# EAGLE design sensor_board_v0.52 (EAGLE 7.7.0)
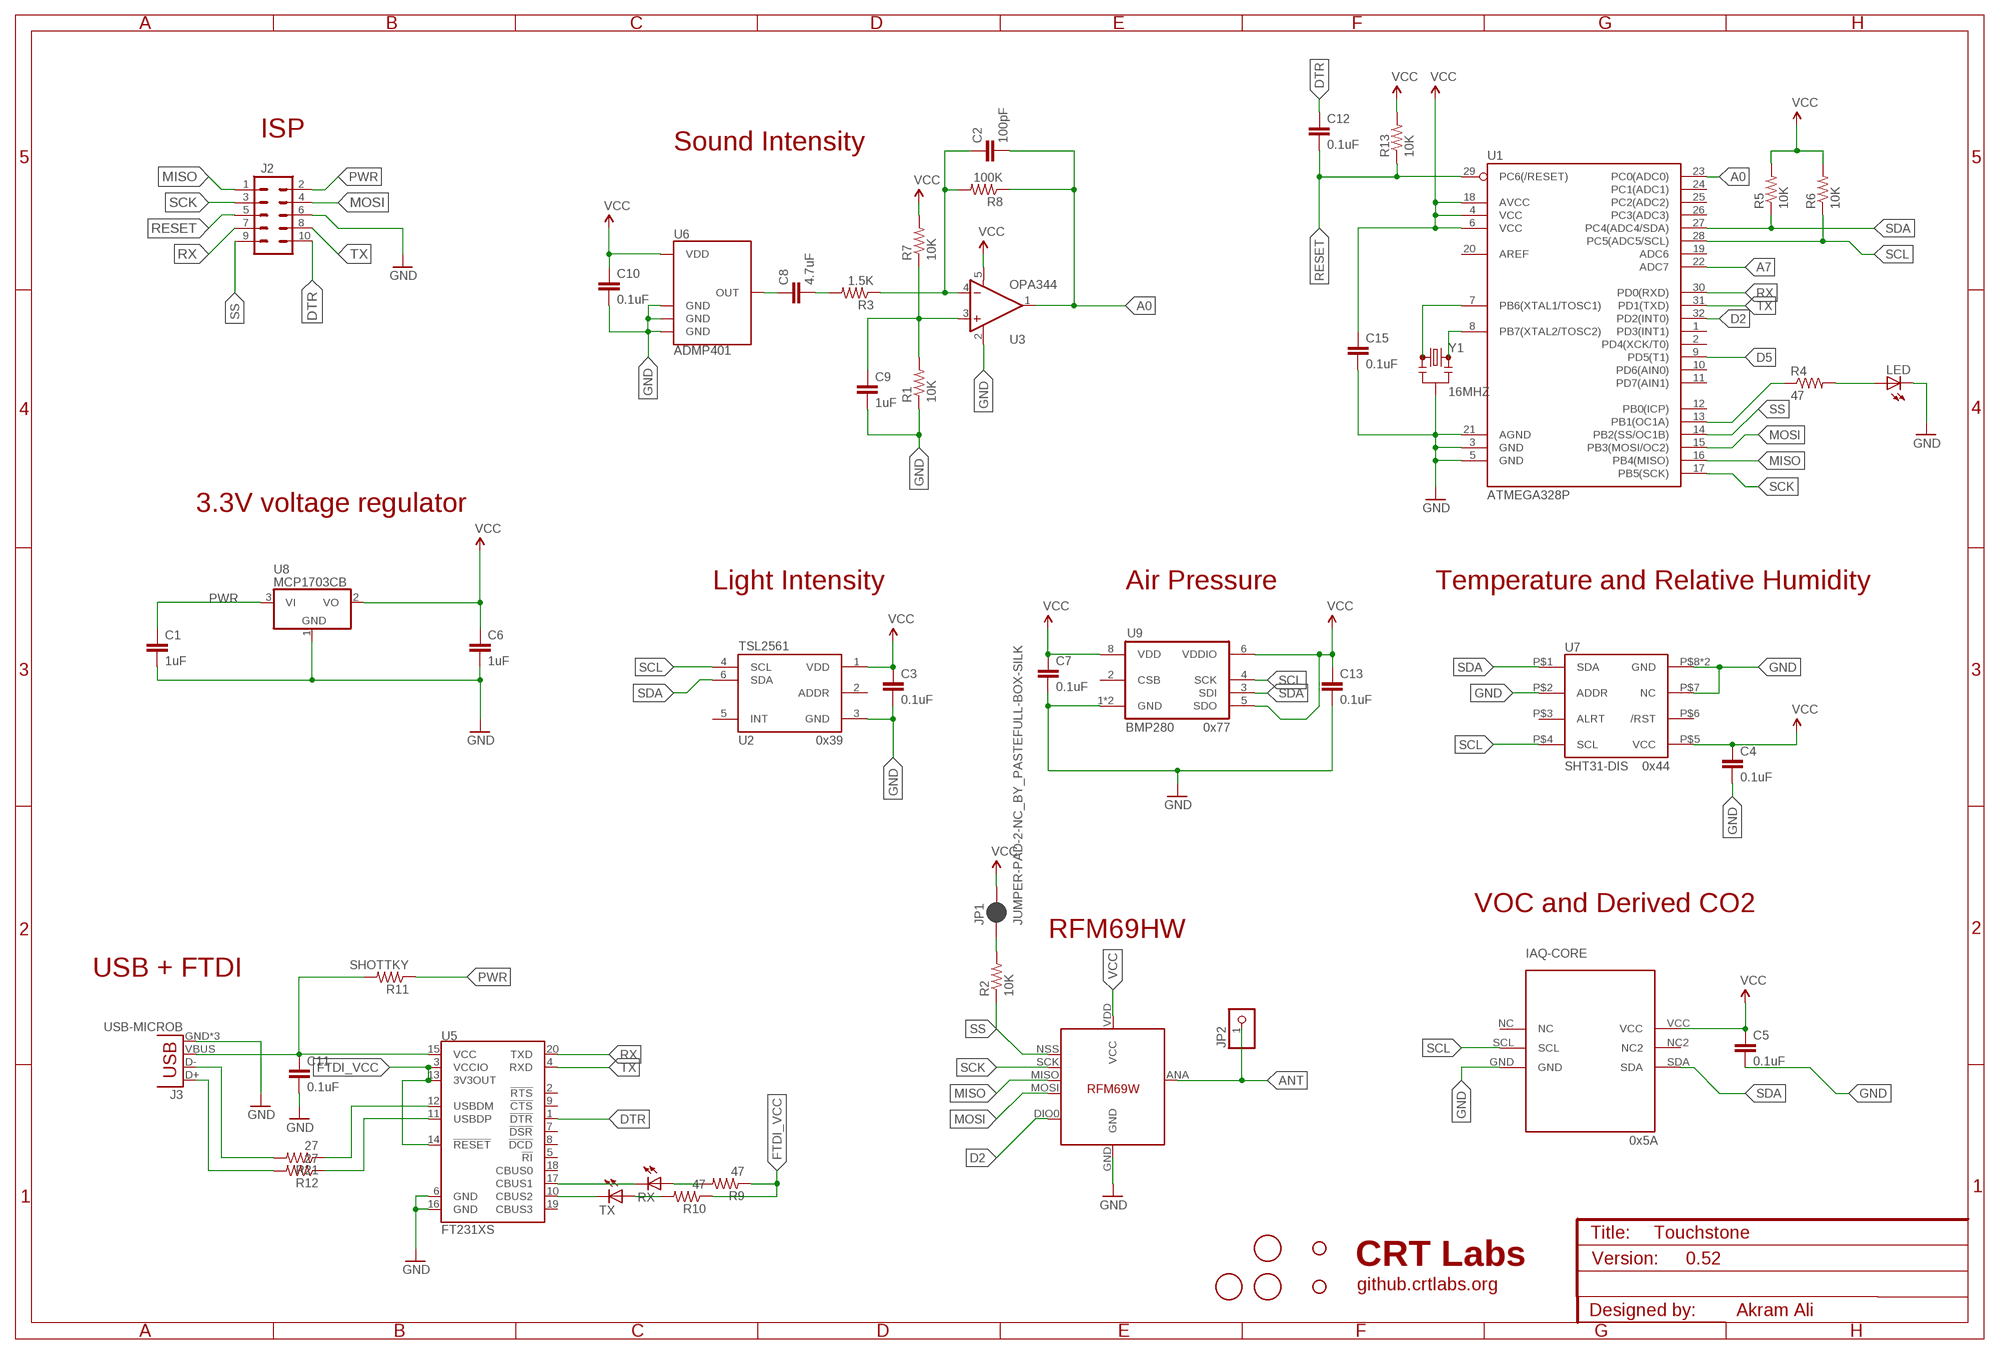
[diagram p0: schematic, sheet 1]

## Parts
C1  1uF  CAP0805  [0805]
C2  100pF  CAP0805  [0805]
C3  0.1uF  CAP0805  [0805]
C4  0.1uF  CAP0805  [0805]
C5  0.1uF  CAP0805  [0805]
C6  1uF  CAP0805  [0805]
C7  0.1uF  CAP0805  [0805]
C8  4.7uF  CAP0805  [0805]
C9  1uF  CAP0805  [0805]
C10  0.1uF  CAP0805  [0805]
C11  0.1uF  CAP0805  [0805]
C12  0.1uF  CAP0805  [0805]
C13  0.1uF  CAP0805  [0805]
C15  0.1uF  CAP0805  [0805]
H1  STAND-OFF  [STAND-OFF]
H2  STAND-OFF  [STAND-OFF]
IAQ-CORE  IAQ-CORE  [IAQ-CORE]
J2  M05X2PTH  [AVR_ICSP]
J3  USB-MICROB  [USB-MICROB]
JP1  JUMPER-PAD-2-NC_BY_PASTEFULL-BOX-SILK  [PAD-JUMPER-2-NC_BY_PASTE_YES_SILK_FULL_BOX]
JP2  PINHD-1X1  [1X01]
LED  LEDCHIPLED_0805  [CHIPLED_0805]
R1  10K  RESISTOR0805-RES  [0805]
R2  10K  RESISTOR0805-RES  [0805]
R3  1.5K  RESISTOR0805-RES  [0805]
R4  47  RESISTOR0805-RES  [0805]
R5  10K  RESISTOR0805-RES  [0805]
R6  10K  RESISTOR0805-RES  [0805]
R7  10K  RESISTOR0805-RES  [0805]
R8  100K  RESISTOR0805-RES  [0805]
R9  47  RESISTOR0805-RES  [0805]
R10  47  RESISTOR0805-RES  [0805]
R11  SHOTTKY  RESISTOR0805-RES  [0805]
R12  27  RESISTOR0805-RES  [0805]
R13  10K  RESISTOR0805-RES  [0805]
R21  27  RESISTOR0805-RES  [0805]
RX  LEDCHIPLED_0805  [CHIPLED_0805]
TX  LEDCHIPLED_0805  [CHIPLED_0805]
U1  ATMEGA328P  ATMEGA328P_TQFP  [TQFP32-08]
U2  TSL2561  TSL2561FN  [FN-6]
U3  OPA344  [SOT23-5]
U4  RFM69HW  LOWPOWERLAB_RFM69  [LOWPOWERLAB_RFM69W-MINPADS]
U5  FT231XS  [SSOP20_L]
U6  ADMP401  [ADMP401]
U7  SHT31-DIS  [SHT3X]
U8  MCP1703CB  [SOT23]
U9  BMP280  [BMP280]
U$1  FIDUCIAL  [FIDUCIAL_1MM]
U$2  FIDUCIAL  [FIDUCIAL_1MM]
U$3  FIDUCIAL  [FIDUCIAL_1MM]
Y1  16MHZ  RESONATOR16MHZ  [RESONATOR-SMD]

## Nets
A0: C2.2 R8.1 U1.23(PC0(ADC0)) U3.1(OUT)
A7: U1.22(ADC7)
ANT: JP2.1 U4.ANA(ANT)
D2: U1.32(PD2(INT0)) U4.DIO0
D5: U1.9(PD5(T1))
DTR: C12.1 J2.10 U5.1(!DTR)
FTDI_VCC: R9.1 R10.1 U5.3(VCCIO) U5.13(3V3OUT) U5.14(!RESET)
GND: C1.2 C3.2 C4.2 C5.2 C6.2 C7.2 C9.2 C10.2 C11.2 C13.2 C15.2 IAQ-CORE.GND J2.6 J3.GND J3.MT1(GND) J3.MT2(GND) LED.C R1.1 U1.3(GND) U1.5(GND) U1.21(AGND) U2.3(GND) U3.2(V-) U4.GND U5.6(GND) U5.16(GND) U6.2(GND) U6.4(GND) U6.6(GND) U7.P$2(ADDR) U7.P$7(NC) U7.P$8(GND) U7.PAD(GND) U8.1(GND) U9.1(GND) U9.7(GND) Y1.2
MISO: J2.1 U1.16(PB4(MISO)) U4.MISO
MOSI: J2.4 U1.15(PB3(MOSI/OC2)) U4.MOSI
N$1: JP1.1 R2.2
N$2: R4.1 U1.13(PB1(OC1A))
N$3: LED.A R4.2
N$4: U1.8(PB7(XTAL2/TOSC2)) Y1.3
N$5: U1.7(PB6(XTAL1/TOSC1)) Y1.1
N$9: C8.2 R3.2
N$10: C2.1 R3.1 R8.2 U3.4(-IN)
N$11: C9.1 R1.2 R7.1 U3.3(+IN)
N$17: RX.C U5.17(CBUS1)
N$18: TX.C U5.10(CBUS2)
N$25: R21.1 U5.12(USBDM)
N$26: R12.1 U5.11(USBDP)
N$27: R9.2 RX.A
N$29: R10.2 TX.A
N$32: J3.D- R21.2
N$33: J3.D+ R12.2
OUT: C8.1 U6.1(OUT)
PWR: C1.1 J2.2 R11.1 U8.3(VI)
RESET: C12.2 J2.5 R13.1 U1.29(PC6(/RESET))
RX: J2.7 U1.30(PD0(RXD)) U5.20(TXD)
SCK: J2.3 U1.17(PB5(SCK)) U4.SCK
SCL: IAQ-CORE.SCL R6.1 U1.28(PC5(ADC5/SCL)) U2.4(SCL) U7.P$4(SCL) U9.4(SCK)
SDA: IAQ-CORE.SDA R5.1 U1.27(PC4(ADC4/SDA)) U2.6(SDA) U7.P$1(SDA) U9.3(SDI)
SS: J2.9 R2.1 U1.14(PB2(SS/OC1B)) U4.NSS(SEL)
TX: J2.8 U1.31(PD1(TXD)) U5.4(RXD)
VBUS: C11.1 J3.VBUS R11.2 U5.15(VCC)
VCC: C3.1 C4.1 C5.1 C6.1 C7.1 C10.1 C13.1 C15.1 IAQ-CORE.VCC JP1.2 R5.2 R6.2 R7.2 R13.2 U1.4(VCC) U1.6(VCC) U1.18(AVCC) U2.1(VDD) U3.5(V+) U4.VDD(VCC) U6.5(VDD) U7.P$5(VCC) U8.2(VO) U9.5(SDO) U9.6(VDDIO) U9.8(VDD)
Unconnected: IAQ-CORE.NC IAQ-CORE.NC2 U1.1(PD3(INT1)) U1.2(PD4(XCK/T0)) U1.10(PD6(AIN0)) U1.11(PD7(AIN1)) U1.12(PB0(ICP)) U1.19(ADC6) U1.20(AREF) U1.24(PC1(ADC1)) U1.25(PC2(ADC2)) U1.26(PC3(ADC3)) U2.2(ADDR) U2.5(INT) U5.2(!RTS) U5.5(!RI) U5.7(!DSR) U5.8(!DCD) U5.9(!CTS) U5.18(CBUS0) U5.19(CBUS3) U7.P$3(ALRT) U7.P$6(/RST) U9.2(CSB)

## Notes on the sheet
- ISP
- Sound Intensity
- 3.3V voltage regulator
- Light Intensity | Air Pressure | Temperature and Relative Humidity
- 0x77
- 0x39
- 0x44
- VOC and Derived CO2
- RFM69HW
- USB + FTDI
- 0x5A
- Touchstone
- CRT Labs | 0.52
- github.crtlabs.org
- Akram Ali

## Library data of the parts
C1 C2 C6 C8-C11 = SparkFun-Capacitors:CAP: Capacitor Standard 0603 ceramic capacitor, and 0.1" leaded capacitor.; OC_NEWARK: unknown
C3-C5 = SparkFun-Passives:CAP: Capacitor Standard 0603 ceramic capacitor, and 0.1" leaded capacitor.; OC_NEWARK: unknown
C7 C12 C13 C15 = SparkFun-Passives:CAP: Capacitor Standard 0603 ceramic capacitor, and 0.1" leaded capacitor.
H1 H2 = SparkFun-Electromechanical:STAND-OFF: #4 Stand Off This is the mechanical footprint for a #4 phillips button head screw. Use the keepout ring to avoid running the screw head into surrounding components. SKU : PRT-00447
IAQ-CORE = IAQ-CORE:IAQ-CORE; MPN: IAQ CORE; OC_NEWARK: 82Y5455
J2 = SparkFun-Connectors:M05X2: Header 5x2 Standard 10-pin dual row 0.1" header. Commonly used with AVR-ISP. Use with Spark Fun Electronics SKU: PRT-00778
J3 = SparkFun-Connectors:USB: USB Connectors USB-B-PTH is fully proven SKU : PRT-00139/CONN-08278 USB-miniB is fully proven SKU : PRT-00587 USB-A-PCB is untested. USB-A-H is throughly reviewed, but untested. Spark Fun Electronics SKU : PRT-00437 USB-B-SMT is throughly reviewed, but untested. Needs silkscreen touching up. USB-A-S has not been used/tested USB-MB-H has not been used/tested USB-MICROB has been used. CONN-09505; PROD_ID: CONN-09505
JP1 = SparkFun-Passives:JUMPER-PAD-2-NC_BY_PASTE
JP2 = adafruit:PINHD-1X1: Pin header 1x1 for 0.1" spacing With round pins
LED RX TX = adafruit:LED: LED OSRAM: - CHIPLED LG R971, LG N971, LY N971, LG Q971, LY Q971, LO R971, LY R971 LH N974, LH R974 LS Q976, LO Q976, LY Q976 LO Q996 - Hyper CHIPLED LW Q18S LB Q993, LB Q99A, LB R99A - SideLED LS A670, LO A670, LY A670, LG A670, LP A670 LB A673, LV A673, LT A673, LW A673 LH A674 LY A675 LS A676, LA A676, LO A676, LY A676, LW A676 LS A679, LY A679, LG A679 - Hyper Micro SIDELED® LS Y876, LA Y876, LO Y876, LY Y876 LT Y87S - SmartLED LW L88C, LW L88S LB L89C, LB L89S, LG L890 LS L89K, LO L89K, LY L89K LS L896, LA L896, LO L896, LY L896 - TOPLED LS T670, LO T670, LY T670, LG T670, LP T670 LSG T670, LSP T670, LSY T670, LOP T670, LYG T670 LG T671, LOG T671, LSG T671 LB T673, LV T673, LT T673, LW T673 LH T674 LS T676, LA T676, LO T676, LY T676, LB T676, LH T676, LSB T676, LW T676 LB T67C, LV T67C, LT T67C, LS T67K, LO T67K, LY T67K, LW E67C LS E67B, LA E67B, LO E67B, LY E67B, LB E67C, LV E67C, LT E67C LW T67C LS T679, LY T679, LG T679 LS T770, LO T770, LY T770, LG T770, LP T770 LB T773, LV T773, LT T773, LW T773 LH T774 LS E675, LA E675, LY E675, LS T675 LS T776, LA T776, LO T776, LY T776, LB T776 LHGB T686 LT T68C, LB T68C - Hyper Mini TOPLED® LB M676 - Mini TOPLED Santana® LG M470 LS M47K, LO M47K, LY M47K Source: http://www.osram.convergy.de/; OC_NEWARK: unknown
R1 R3 R7-R12 R21 = SparkFun-Passives:RESISTOR: Resistor Basic schematic elements and footprints for 0603, 1206, and PTH resistors.; OC_NEWARK: unknown
R2 R13 = SparkFun-Passives:RESISTOR: Resistor Basic schematic elements and footprints for 0603, 1206, and PTH resistors.
R4-R6 = SparkFun-Resistors:RESISTOR: Resistor Basic schematic elements and footprints for 0603, 1206, and PTH resistors.; OC_NEWARK: unknown
U1 = SparkFun-DigitalIC:ATMEGA328P_TQFP; MPN: ATMEGA328PB-AU; OC_NEWARK: 58Y6083; PROD_ID: IC-09069; VALUE: ATMEGA328P_TQFP
U2 = SparkFun-DigitalIC:TSL2561: TSL2561 illumination sensor Approximates Human Eye Response Precisely Measures Illuminance Programmable Interrupt Function with User-Defined Upper and Lower Threshold 400 KHz I2C interface Programmable Analog Gain and Integration Time Supporting 1,000,000-to-1 Dynamic Range Automatically Rejects 50/60-Hz Lighting Ripple Low Active Power (0.75 mW Typical) with Power Down Mode RoHS Compliant The TSL2561 is a light-to-digital converter that transform light intensity to a digital signal output via I2C interface. The device combines one broadband photodiode (visible plus infrared) and one infrared-responding photodiode on a single CMOS integrated circuit capable of providing a near-photopic response over an effective 20-bit dynamic range (16-bit resolution). Two integrating ADCs convert the photodiode currents to a digital output that represents the irradiance measured on each channel. This digital output can be input to a microprocessor where illuminance (ambient light level) in lux is derived using an empirical formula to approximate the human eye response. The TSL2561 device supports a traditional level style interrupt that remains asserted until the firmware clears it.; DIGIKEY#: TSL2561-FNCT-ND; MANF: AMS-TAOS-USA-Inc.; MANF#: TSL2561FN; MOUSER#: 856-TSL2561T; MPN: TSL2561FN; OC_NEWARK: 82Y5564; PROD_ID: IC-11791
U3 = SparkFun-AnalogIC:OPA344: Single gate rail-to-rail output op-amp. Inputs extend 300mV past rails.; PROD_ID: IC-08251
U4 = RFM69 USB Gateway:LOWPOWERLAB_RFM69
U5 = SparkFun-DigitalIC:FT231X: FTDI FT231X Full Speed USB to Full-handshake UART This USB2.0 Full Speed IC offers a compact bridge to full handshake UART interfaces. The device is a UART, capable of operating up to 3MBaud, with low power consumption (8mA). The FT231X includes the complete FT-X series feature set and enables USB to be added into a system design quickly and easily over a UART interface.; PROD_ID: IC-11524
U6 = SparkFun-Sensors:ADMP401: Omnidirection bottom-port MEMS microphone
U7 = thomasb9511:SHT31-DIS; MPN: SHT31-DIS-B; OC_NEWARK: 47Y1304
U8 = linear:MCP1703: 250 mA, 16V, Low Quiescent Current LDO Regulator Source: http://ww1.microchip.com/downloads/en/DeviceDoc/22049b.pdf; MPN: MCP1703T-2502E/CB; OC_NEWARK: 18T9177
U9 = bosch-bmp280:BMP280: The BMP280 is an absolute barometric pressure sensor especially designed for mobile applications. The sensor module is housed in an extremely compact 8-pin metal-lid LGA package with a footprint of only 2.0 × 2.5 mm2 and 0.95 mm package height. Its small dimensions and its low power consumption of 2.7 μA @1Hz allow the implementation in battery driven devices such as mobile phones, GPS modules or watches. The library has been designed by Richard Magdycz <https://www.facebook.com/groups/eaglecadsoftUK>
U$1-U$3 = adafruit:FIDUCIAL: For use by pick and place machines to calibrate the vision/machine, 1mm By microbuilder.eu
Y1 = SparkFun-FreqCtrl:RESONATOR: Resonator Small SMD resonator. Used, eg, on the Arduino Pro/ Pro Mini boards. 8MHz- XTAL-08895 16MHz- XTAL-08900; OC_NEWARK: unknown; PROD_ID: XTAL-08900

## Board
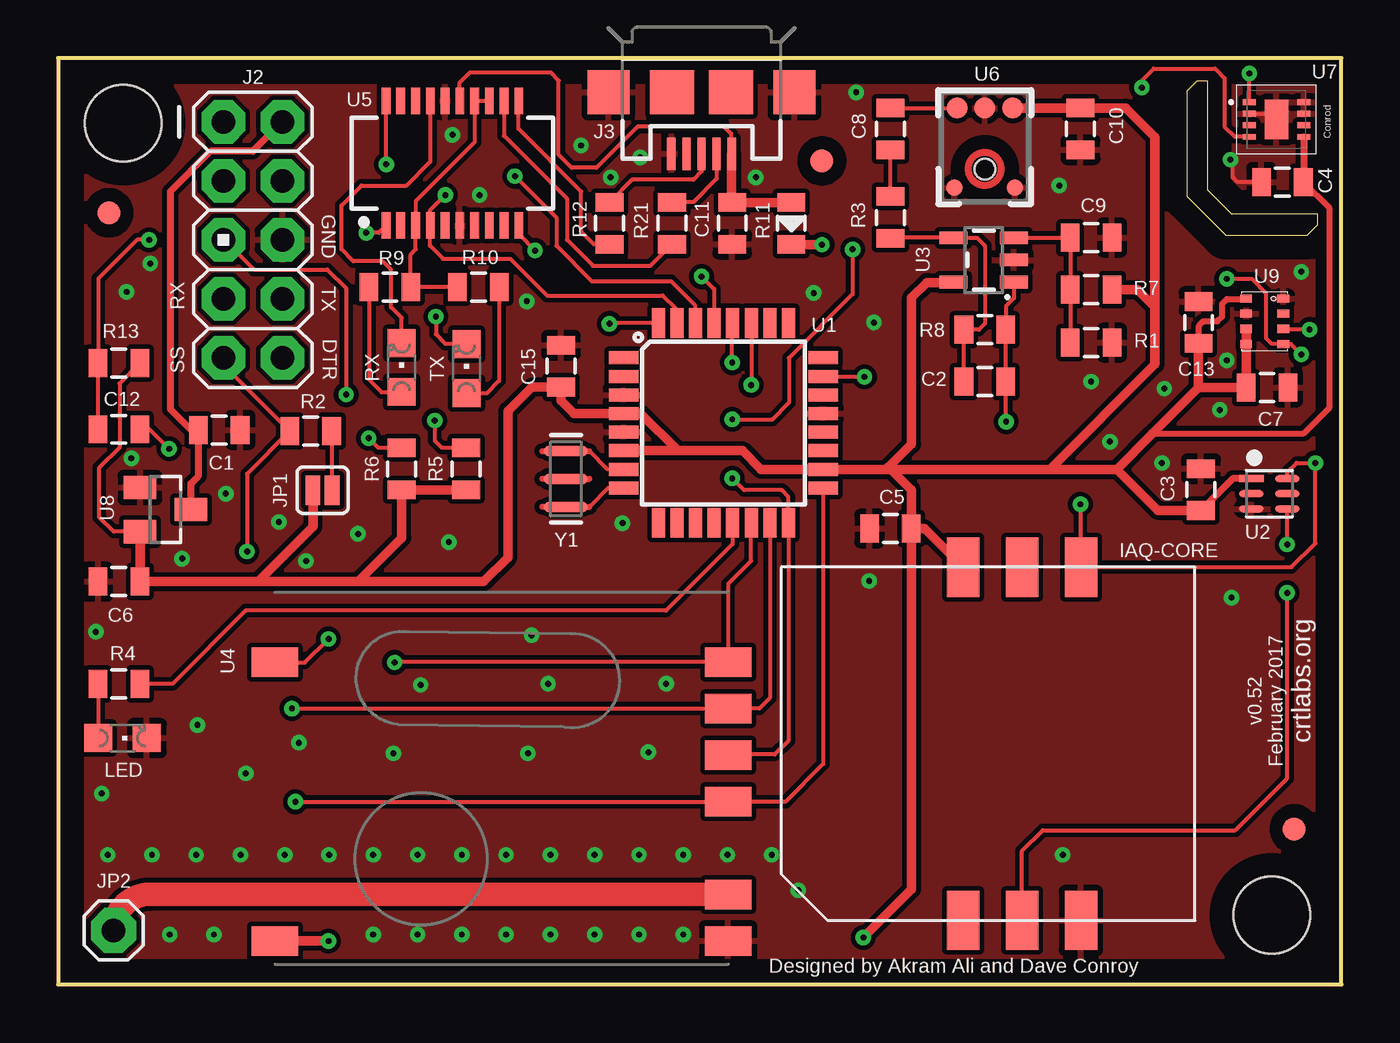
[diagram p1: board, top side]
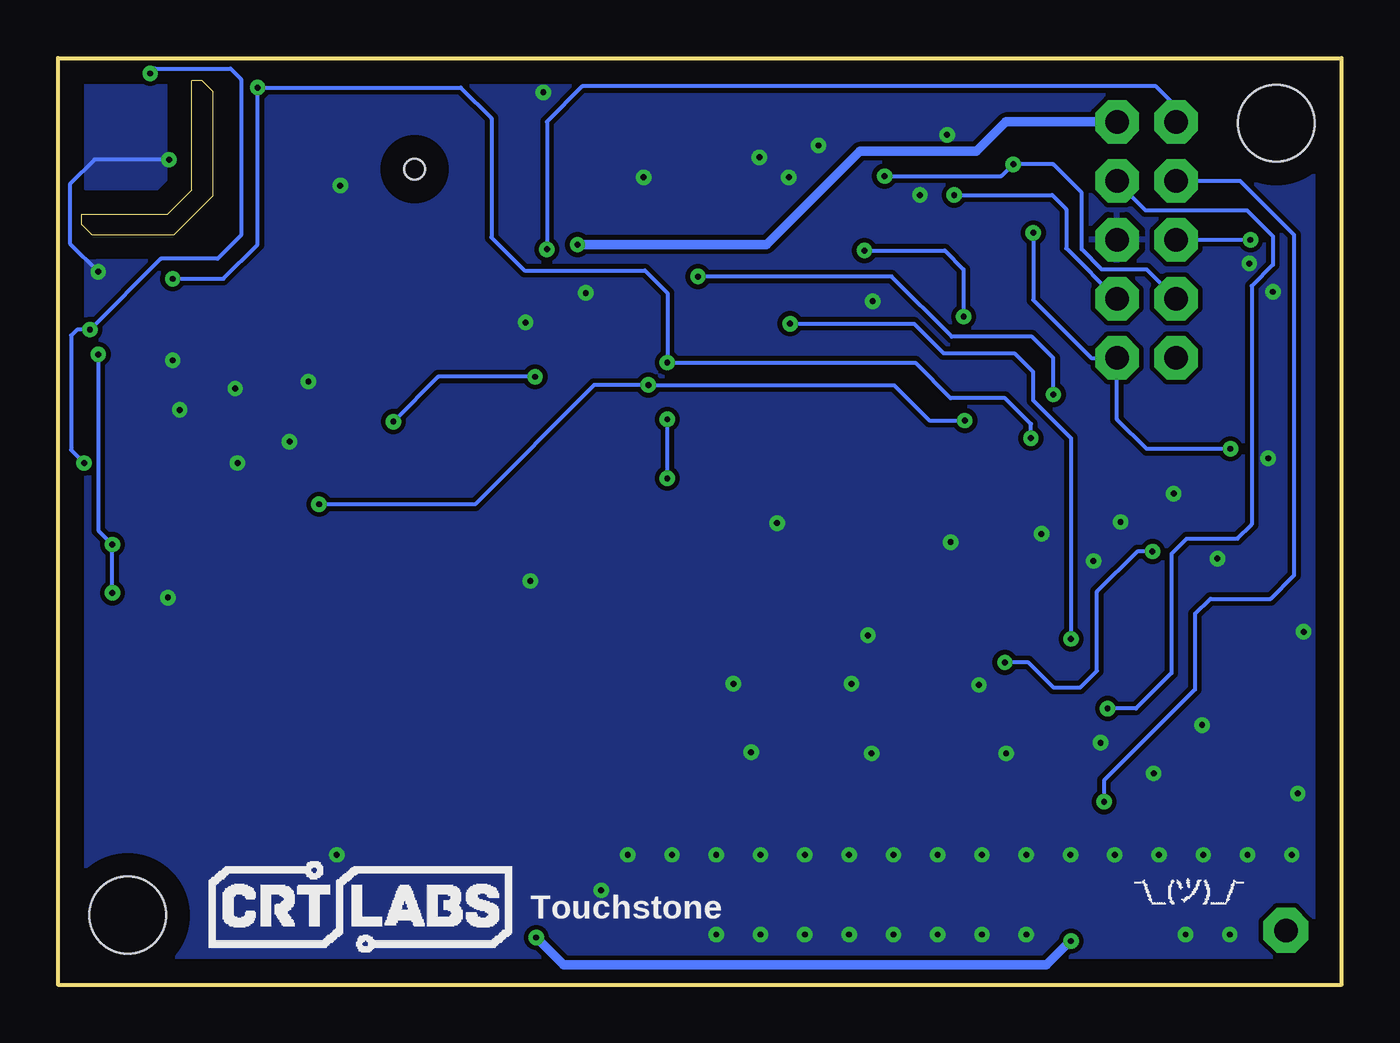
[diagram p2: board, bottom side, seen from below]

Size 55.22 x 39.88 mm. Coordinates in mm from the lower left corner, seen from the top.
Outline: 0,39.88 0,0 55.22,0 55.22,39.88 0,39.88
Outline: 49.48,34.19 49.48,38.91 49.02,38.91 48.56,38.46 48.56,33.93 50.24,32.26 53.75,32.26 54.2,32.72 54.2,33.17 50.5,33.17 49.48,34.19
Copper layers (1*16): Top 0.035mm / dielectric 1.5mm / Bottom 0.035mm
Design rules "default": minimum track width 10mil, minimum drill 24mil, track to track 8mil, track to pad 8mil, pad to pad 8mil, via to via 8mil, smd to smd 8mil, copper to edge 40mil, drill to drill 8mil, minimum pad ring 10mil, minimum via ring 8mil, stop-mask expansion 4mil, vias tented up to drill 0mil, thermal gap 10mil

### Footprints (pad centres in the part's own frame; a part is rotated, then mirrored left to right if it is on the bottom)
0805 = smd 0.8 x 1.2: 1 -0.9,0; 2 0.9,0
STAND-OFF = hole 3.302: 0,0
IAQ-CORE = smd 2.54 x 1.4: GND 0,-12.9; NC 0,-7.82; NC2 15.2,-10.36; SCL 0,-10.36; SDA 15.2,-12.9; VCC 15.2,-7.82
AVR_ICSP = drill 1.016 pad 1.88 octagon: 1 -1.27,5.08; 2 1.27,5.08; 3 -1.27,2.54; 4 1.27,2.54; 5 -1.27,0; 6 1.27,0; 7 -1.27,-2.54; 8 1.27,-2.54; 9 -1.27,-5.08; 10 1.27,-5.08
USB-MICROB = smd 0.35 x 1.4: D+ 0,2.65; D- -0.65,2.65; GND 1.3,2.65; ID 0.65,2.65; VBUS -1.3,2.65 | smd 1.8 x 1.9: MT1 -4,0; MT2 4,0 | smd 1.9 x 1.9: P$1 -1.27,0; P$2 1.27,0
PAD-JUMPER-2-NC_BY_PASTE_YES_SILK_FULL_BOX = smd 0.635 x 1.27: 1 -0.412,0; 2 0.412,0
1X01 = drill 1.016 pad 1.93 octagon: 1 0,0
CHIPLED_0805 = smd 1.2 x 1.2: A 0,-1.05; C 0,1.05
TQFP32-08 = smd 1.27 x 0.559: 1 -4.293,2.8; 2 -4.293,2; 3 -4.293,1.2; 4 -4.293,0.4; 5 -4.293,-0.4; 6 -4.293,-1.2; 7 -4.293,-2; 8 -4.293,-2.8; 17 4.293,-2.8; 18 4.293,-2; 19 4.293,-1.2; 20 4.293,-0.4; 21 4.293,0.4; 22 4.293,1.2; 23 4.293,2; 24 4.293,2.8 | smd 0.559 x 1.27: 9 -2.8,-4.293; 10 -2,-4.293; 11 -1.2,-4.293; 12 -0.4,-4.293; 13 0.4,-4.293; 14 1.2,-4.293; 15 2,-4.293; 16 2.8,-4.293; 25 2.8,4.293; 26 2,4.293; 27 1.2,4.293; 28 0.4,4.293; 29 -0.4,4.293; 30 -1.2,4.293; 31 -2,4.293; 32 -2.8,4.293
FN-6 = smd 1.05 x 0.3: 1 -0.775,0.65; 2 -0.775,0; 3 -0.775,-0.65; 4 0.775,-0.65; 5 0.775,0; 6 0.775,0.65
SOT23-5 = smd 0.55 x 1.2: 1 -0.95,-1.3; 2 0,-1.3; 3 0.95,-1.3; 4 0.95,1.3; 5 -0.95,1.3
LOWPOWERLAB_RFM69W-MINPADS = smd 2 x 1.27: ANA 8,-5; DIO0 -11.5,5; GND 8,-7; MISO 8,1; MOSI 8,3; NSS 8,5; SCK 8,-1; VDD -11.5,-7
SSOP20_L = smd 0.381 x 1.143: 1 -2.857,-2.68; 2 -2.223,-2.68; 3 -1.587,-2.68; 4 -0.953,-2.68; 5 -0.318,-2.68; 6 0.318,-2.68; 7 0.953,-2.68; 8 1.587,-2.68; 9 2.223,-2.68; 10 2.857,-2.68; 11 2.857,2.68; 12 2.223,2.68; 13 1.587,2.68; 14 0.953,2.68; 15 0.318,2.68; 16 -0.318,2.68; 17 -0.953,2.68; 18 -1.587,2.68; 19 -2.223,2.68; 20 -2.857,2.68
ADMP401 = smd 0.9 x 0.9: 1 -1.2,2.62; 5 1.2,2.62; 6 0,2.62 | smd 0.7 x 0.7: 2 1.3,-0.8; 4 -1.3,-0.8 | hole 0.9: 0,0
SHT3X = smd 0.55 x 0.25: P$1 -1.175,0.75; P$2 -1.175,0.25; P$3 -1.175,-0.25; P$4 -1.175,-0.75; P$5 1.175,-0.75; P$6 1.175,-0.25; P$7 1.175,0.25; P$8 1.175,0.75 | smd 1 x 1.7: PAD 0,0
SOT23 = smd 1 x 1.4: 1 -0.95,-1.1; 2 0.95,-1.1; 3 0,1.1
BMP280 = smd 0.35 x 0.5: 1 0.975,-0.8; 2 0.325,-0.8; 3 -0.325,-0.8; 4 -0.975,-0.8; 5 -0.975,0.8; 6 -0.325,0.8; 7 0.325,0.8; 8 0.975,0.8
FIDUCIAL_1MM = smd 1 x 1: 1 0,0
RESONATOR-SMD = smd 0.45 x 1.905: 1 -1.2,0; 2 0,0; 3 1.2,0

### Placement (x,y rotation side)
C1  6.93,23.88 0 top
C2  39.88,25.96 0 top
C3  49.17,21.31 90 top
C4  52.68,34.54 180 top
C5  35.81,19.63 180 top
C6  2.62,17.35 180 top
C7  52.02,25.7 0 top
C8  35.81,36.83 270 top
C9  44.45,32.16 0 top
C10  43.99,36.83 270 top
C11  29.01,32.77 270 top
C12  2.62,23.9 180 top
C13  49.07,28.5 90 top
C15  21.64,26.62 90 top
H1  2.79,37.08 0 top
H2  52.22,3 0 top
IAQ-CORE  31.12,2.77 90 top
J2  8.38,32.05 0 top
J3  27.69,38.4 180 top
JP1  11.38,21.29 180 top
JP2  2.39,2.34 0 top
LED  2.77,10.62 270 top
R1  44.45,27.64 180 top
R2  10.87,23.83 0 top
R3  35.81,33.02 90 top
R4  2.62,12.95 180 top
R5  17.55,22.2 270 top
R6  14.78,22.2 270 top
R7  44.45,29.92 0 top
R8  39.88,28.19 180 top
R9  14.27,30.02 180 top
R10  18.08,30.02 0 top
R11  31.55,32.77 90 top
R12  23.72,32.77 90 top
R13  2.62,26.75 0 top
R21  26.42,32.77 90 top
RX  14.78,26.57 0 top
TX  17.58,26.52 0 top
U1  28.63,24.18 0 top
U2  52.12,21.13 0 top
U3  39.83,31.19 90 top
U4  20.83,8.89 0 top
U5  16.97,35.36 0 top
U6  39.88,35.1 0 top
U7  52.43,37.24 0 top
U8  4.62,20.45 270 top
U9  51.92,28.55 90 top
U$1  53.19,6.71 0 top
U$2  2.18,33.22 0 top
U$3  32.87,35.46 0 top
Y1  21.84,21.77 270 top

### Tracks (layer width: path | path; a pad name or v marks a point on that pad's centre or on a via)
A0  (via drill 0.25 pad 0.13)
  Top 0.178: U3.1 41.13,29.55 40.79,29.21 40.79,28.21 R8.1 C2.2 40.79,25.94 v40.79,24.23 | U1.23 34.68,26.18 v34.7,26.16
  Bottom 0.178: v34.7,26.16 38.86,26.16 v40.79,24.23
ANT
  Top 1.016: U4.ANA 3.94,3.89 arc90 JP2.1
D2  (via drill 0.25 pad 0.13)
  Top 0.178: U1.32 23.75,28.47 v23.72,28.45 | U4.DIO0 9.35,13.87 10.62,13.87 v11.63,14.88
  Bottom 0.178: v23.72,28.45 18.39,28.45 17.12,27.18 14.07,27.18 13.26,26.37 13.26,25.15 11.63,23.52 v11.63,14.88
DTR  (via drill 0.25 pad 0.13)
  Top 0.178: C12.1 3.94,23.9 v4.78,23.06 | U5.1 13.79,32.36 v13.26,32.36
  Bottom 0.178: v4.78,23.06 8.38,23.06 9.65,24.33 J2.10 10.77,26.98 13.26,29.46 v13.26,32.36
FTDI_VCC
  Top 0.178: U5.13 U5.14 17.92,36.26 15.39,33.73 15.39,32.69 U5.3 15.39,32.66 15.39,31.65 15.17,31.43 R9.1 R10.1
GND  (via drill 0.25 pad 0.13)
  Top 0.178: C4.2 50.75,34.54 50.55,34.75 50.55,35.41 v50.44,35.51 | U7.P$2 52.18,37.49 U7.PAD
  Bottom 0.178: v50.44,35.51 53.64,35.51 54.71,34.44 54.71,31.9 v53.49,30.68
  other vias: 18.14,33.99 16.97,36.58 47.6,25.65 44.45,25.96 47.5,22.45 45.26,23.37 49.99,24.74 22.5,36.12 23.77,34.75 25.04,35.61 30.02,34.75 1.88,8.23 15.6,12.9 43.23,5.59 34.9,17.37 32.51,29.77 50.5,16.66 43.08,34.39 34.34,38.4 24.28,19.86 16.81,19.05 12.9,19.41 7.21,21.13 3.96,31.04 26.9,5.59 24.99,5.59 23.09,5.59 21.18,5.59 19.28,5.59 17.37,5.59 15.47,5.59 13.56,5.59 11.66,5.59 9.75,5.59 7.85,5.59 26.9,2.16 24.99,2.16 23.09,2.16 21.18,2.16 19.28,2.16 17.37,2.16 15.47,2.16 13.56,2.16 5.94,5.59 28.8,5.59 30.71,5.59 31.85,4.06 10.67,18.24 9.5,19.91 5.33,18.34 20.37,15.04 20.17,29.41 35.1,28.5 25.4,10.01 20.22,9.96 14.43,9.96 10.36,10.41 26.16,12.95 21.08,12.95 2.95,29.82 3.15,22.66 1.63,15.19 5.99,11.18 8.08,9.09 4.04,5.59 2.13,5.59 6.71,2.16 4.8,2.16 50.29,26.87
  pour Top: -0.1,-0.2 55.73,-0.2 55.73,40.44 -0.1,40.44
  pour Bottom: -0.05,40.49 -0.05,-0.2 55.93,-0.2 55.93,40.44 0,40.44 0,40.49
MISO  (via drill 0.25 pad 0.13)
  Top 0.178: U4.MISO 28.84,9.91 30.84,9.91 31.43,10.5 U1.16 31.43,21 31.14,21.29 29.51,21.29 v29.01,21.79 | v34.19,31.65 34.19,29.72 31.45,26.98 31.45,25.04 30.73,24.33 v29.01,24.33
  Bottom 0.178: J2.1 7.11,37.8 7.98,38.66 32.66,38.66 34.19,37.13 v34.19,31.65 | v29.01,21.79 v29.01,24.33
MOSI  (via drill 0.25 pad 0.13)
  Top 0.178: U1.15 30.63,12.34 30.18,11.89 U4.MOSI v10.06,11.89
  Bottom 0.178: J2.4 9.65,34.54 8.43,33.33 4.06,33.33 2.95,32.21 2.95,30.99 3.86,30.07 3.86,19.81 4.47,19.2 6.65,19.2 7.32,18.54 7.32,13.41 8.84,11.89 v10.06,11.89
N$1
  Top 0.178: JP1.1 11.79,23.8 R2.2
N$2
  Top 0.178: U1.13 29.03,18.97 26.16,16.1 8.08,16.1 4.93,12.95 R4.1
N$3
  Top 0.178: R4.2 LED.A
N$4
  Top 0.178: U1.8 23.67,21.38 22.86,20.57
N$5
  Top 0.178: U1.7 23.65,22.18 22.86,22.97
N$9
  Top 0.178: R3.2 C8.2
N$10
  Top 0.178: C2.1 R8.2 39.62,28.19 39.88,28.45 39.88,31.8 39.54,32.14 U3.4 35.84,32.14 R3.1
N$11
  Top 0.178: U3.3 43.53,32.14 C9.1 R7.1 R1.2
N$17
  Top 0.178: RX.C 14.78,28.7 14.33,29.16 14.33,30.79 13.97,31.14 12.7,31.14 12.19,31.65 12.19,33.53 13.06,34.39 14.99,34.39 16.01,35.42 U5.17
N$18  (via drill 0.25 pad 0.13)
  Top 0.178: U5.10 19.82,32.3 v20.52,31.6 | v16.26,28.75 16.26,27.99 16.66,27.58 17.56,27.58 TX.C
  Bottom 0.178: v20.52,31.6 17.07,31.6 16.26,30.79 v16.26,28.75
N$25
  Top 0.178: U5.12 19.19,36.54 21.89,33.83 21.89,32.05 23.01,30.94 25.49,30.94 R21.1
N$26
  Top 0.178: R12.1 23.05,31.87 22.5,32.41 22.5,34.14 19.81,36.83 19.81,38.02 U5.11
N$27
  Top 0.178: R9.2 13.37,26.05 13.92,25.5 14.77,25.5 RX.A
N$29
  Top 0.178: R10.2 18.98,25.99 18.44,25.45 17.59,25.45 TX.A
N$32
  Top 0.178: J3.D- 28.34,34.69 27.33,33.68 26.43,33.68 R21.2
N$33
  Top 0.178: J3.D+ 27.69,35 27.33,34.65 24.7,34.65 R12.2
OUT
  Top 0.178: C8.1 U6.1
PWR  (via drill 0.25 pad 0.13)
  Top 0.305: 31.56,31.85 R11.1 | J2.2 8.38,35.87 6.55,35.87 4.83,34.14 4.83,24.78 5.73,23.88 C1.1 6.05,23.87 6.05,21.89 5.72,21.57 U8.3
  Top 0.406: v32.87,31.85 31.56,31.85
  Bottom 0.406: J2.2 14.43,37.13 15.7,35.87 20.73,35.87 24.74,31.85 v32.87,31.85
RESET  (via drill 0.25 pad 0.13)
  Top 0.178: C12.2 R13.1 1.73,26.76 1.73,30.38 3.4,32.05 v3.91,32.05 | J2.5 7.16,32.05 8.43,30.79 11.58,30.79 12.4,29.97 v12.4,25.4 | v27.69,30.48 28.23,29.94 U1.29
  Bottom 0.178: v27.69,30.48 19.35,30.48 16.76,27.89 13.31,27.89 12.4,26.98 v12.4,25.4 | J2.5 v3.91,32.05
RX  (via drill 0.25 pad 0.13)
  Top 0.178: U1.30 27.43,29.22 26.37,30.28 22.96,30.28 21.44,31.8 21.44,33.02 v19.66,34.8 | v14.12,35.31 14.12,38.02 U5.20
  Bottom 0.178: v19.66,34.8 14.63,34.8 v14.12,35.31 12.4,35.31 11.18,34.09 11.18,31.65 10.31,30.79 8.38,30.79 J2.7
SCK  (via drill 0.25 pad 0.13)
  Top 0.178: U1.17 32.92,9.5 31.29,7.87 28.84,7.87 U4.SCK 28.81,7.87 v10.21,7.87
  Bottom 0.178: J2.3 4.37,34.59 2.03,32.26 2.03,17.63 3.05,16.61 5.64,16.61 6.3,15.95 6.3,12.7 10.21,8.79 v10.21,7.87
SCL  (via drill 0.25 pad 0.13)
  Top 0.178: R6.1 13.78,23.1 v13.36,23.52 | v29.01,26.77 29.01,28.45 U1.28 | v53.49,27.13 53.04,27.58 U9.4 52.23,27.58 51.97,27.84 51.97,29.77 51.36,30.38 v50.29,30.38 | v52.88,18.95 52.88,20.47 U2.4 | IAQ-CORE.SCL 41.47,5.76 42.37,6.66 50.65,6.66 52.88,8.89 v52.88,16.87 | v46.63,38.61 46.63,38.91 47.14,39.42 49.78,39.42 50.19,39.01 50.19,36.93 50.64,36.49 U7.P$4
  Bottom 0.178: v13.36,23.52 13.36,24.13 14.48,25.25 16.81,25.25 18.34,26.77 v29.01,26.77 29.01,29.77 29.97,30.73 35.15,30.73 36.58,32.16 36.58,37.29 37.9,38.61 v46.63,38.61 46.63,31.85 48.11,30.38 v50.29,30.38 | v53.49,27.13 53.49,19.56 v52.88,18.95 v52.88,16.87
SDA  (via drill 0.25 pad 0.13)
  Top 0.178: U1.27 v29.83,25.81 v29.82,25.81 | v16.21,24.28 16.21,23.42 16.51,23.11 17.54,23.11 R5.1 | v53.85,28.19 52.75,28.19 U9.3 | U2.6 52.9,22.06 53.29,22.45 v54.1,22.45 54.1,19 53.07,17.97 IAQ-CORE.SDA 43.99,17.99 v43.99,20.68 | U7.P$1 v51.25,39.21 v51.26,39.22
  Bottom 0.178: v29.82,25.81 19.25,25.81 17.73,24.28 v16.21,24.28 | v54.1,22.45 54.66,23.01 54.66,27.94 54.41,28.19 v53.85,28.19 50.8,31.24 48.36,31.24 47.35,32.26 47.35,38.96 47.8,39.42 51.05,39.42 v51.26,39.22 | v29.83,25.81 32.15,25.81 37.29,20.68 v43.99,20.68
SS  (via drill 0.25 pad 0.13)
  Top 0.178: U1.14 29.82,18.24 28.83,17.25 U4.NSS 14.5,13.89 v14.48,13.87 | J2.9 7.11,26.68 R2.1 8.13,21.98 v8.13,18.64
  Bottom 0.178: v14.48,13.87 13.46,13.87 12.4,12.8 11.23,12.8 10.52,13.51 10.52,16.92 8.79,18.64 v8.13,18.64
TX  (via drill 0.25 pad 0.13)
  Top 0.178: U1.31 26.63,29.05 26.01,29.67 21.03,29.67 19.46,31.24 16.56,31.24 16,31.8 16,32.66 U5.4 16.01,33.34 v16.66,33.98
  Bottom 0.178: v16.66,33.98 12.45,33.98 11.84,33.38 11.84,31.7 J2.8
VBUS
  Top 0.178: U5.15 17.28,38.82 17.73,39.27 21.18,39.27 21.54,38.91 21.54,35.71 22.1,35.15 23.16,35.15 24.94,36.93 28.65,36.93 28.96,36.63 28.96,35.79 J3.VBUS
  Top 0.305: 28.99,33.69 C11.1
  Top 0.406: J3.VBUS 28.99,33.69 | C11.1 R11.2
VCC  (via drill 0.25 pad 0.13)
  Top 0.178: U8.2 2.4,19.5 1.78,20.12 1.78,22.25 2.64,23.11 2.64,25.87 R13.2
  Top 0.254: 47.09,23.72 53.59,23.72 54.71,24.84 54.71,33.41 C4.1 | 49.09,27.58 49.09,28.36 49.28,28.55 49.89,28.55 50.09,28.75 50.09,29.31 50.29,29.52 51.11,29.52 U9.8
  Top 0.305: C6.1 | U7.P$5 53.6,34.56 C4.1 | U2.1 50.55,21.78 C3.1 | 36.73,19.62 C5.1
  Top 0.406: U8.2 C6.1 | 8.61,17.35 C6.1 | 8.61,17.35 10.97,19.71 JP1.2 | 8.61,17.35 12.9,17.35 | 12.9,17.35 18.31,17.35 19.35,18.39 19.35,24.69 20.39,25.72 C15.1 21.64,25.15 22.2,24.59 U1.4 25.07,24.58 26.67,22.98 | 12.9,17.35 14.78,19.23 R6.2 R5.2 | 35.64,22.18 U1.18 30.24,22.18 29.44,22.98 26.67,22.98 | 35.64,22.18 35.74,22.28 | 35.74,22.28 36.73,23.27 36.73,29.57 37.39,30.23 38.51,30.23 U3.5 | U1.6 26.67,22.98 | 35.64,22.18 42.67,22.18 | 42.67,22.18 45.55,22.18 | 49.16,20.42 C3.1 47.32,20.41 45.55,22.18 | 35.74,22.28 36.71,21.3 C5.1 37.27,19.63 IAQ-CORE.VCC | 49.07,25.7 C7.1 U9.5 U9.6 | 49.07,25.7 C13.1 49.09,27.58 | 45.55,22.18 47.09,23.72 49.07,25.7 | 47.19,29.16 47.19,36.47 45.94,37.73 C10.1 41.09,37.73 U6.5 | 47.19,29.16 47.19,26.7 42.67,22.18 | 36.73,19.62 36.73,4.11 v34.65,2.03 | U4.VDD 11.62,1.89 v11.63,1.88 | R7.2 46.43,29.92 47.19,29.16
  Bottom 0.406: v11.63,1.88 11.68,1.88 12.7,0.86 33.48,0.86 v34.65,2.03

### Text on the board
_tsilk: Conrod | GND | RX | TX | SS | DTR | crtlabs.org | v0.52 / February 2017 | Designed by Akram Ali and Dave Conroy
_bsilk: Touchstone